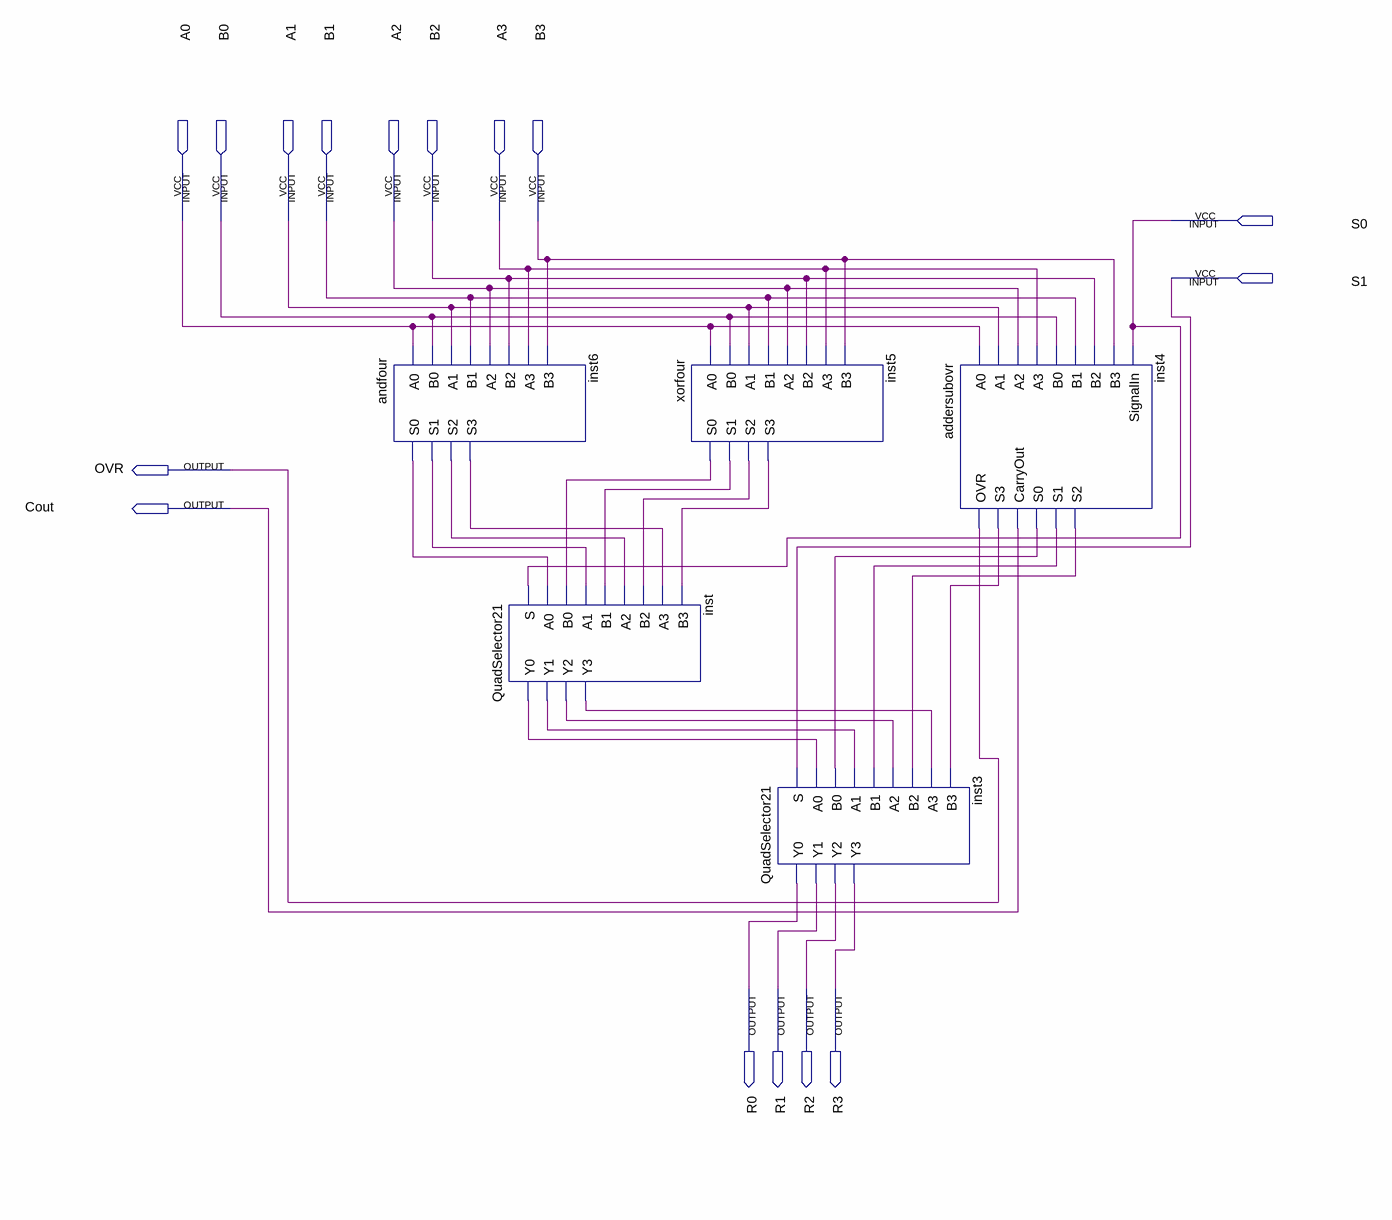
[diagram p0: schematic sheet]
// Quartus schematic alu.bdf as structural Verilog: 5 symbols, 16 pins
module alu (
  input  A0,
  input  B0,
  input  A1,
  input  B1,
  input  A2,
  input  B2,
  input  A3,
  input  B3,
  input  S0,
  input  S1,
  output OVR,
  output Cout,
  output R0,
  output R1,
  output R2,
  output R3
);

  wire inst4_s0, inst4_s1, inst4_s2, inst4_s3, inst5_s0, inst5_s1, inst5_s2, inst5_s3, inst6_s0, inst6_s1,
       inst6_s2, inst6_s3, inst_y0, inst_y1, inst_y2, inst_y3;

  andfour inst6 (
    .A0(A0), .B0(B0), .A1(A1), .B1(B1), .A2(A2), .B2(B2), .A3(A3), .B3(B3), .S0(inst6_s0), .S1(inst6_s1),
    .S2(inst6_s2), .S3(inst6_s3));
  QuadSelector21 inst (
    .S(S0), .A0(inst6_s0), .B0(inst5_s0), .A1(inst6_s1), .B1(inst5_s1), .A2(inst6_s2), .B2(inst5_s2),
    .A3(inst6_s3), .B3(inst5_s3), .Y0(inst_y0), .Y1(inst_y1), .Y2(inst_y2), .Y3(inst_y3));
  xorfour inst5 (
    .A0(A0), .B0(B0), .A1(A1), .B1(B1), .A2(A2), .B2(B2), .A3(A3), .B3(B3), .S0(inst5_s0), .S1(inst5_s1),
    .S2(inst5_s2), .S3(inst5_s3));
  QuadSelector21 inst3 (
    .S(S1), .A0(inst_y0), .B0(inst4_s0), .A1(inst_y1), .B1(inst4_s1), .A2(inst_y2), .B2(inst4_s2),
    .A3(inst_y3), .B3(inst4_s3), .Y0(R0), .Y1(R1), .Y2(R2), .Y3(R3));
  addersubovr inst4 (
    .A0(A0), .A1(A1), .A2(A2), .A3(A3), .B0(B0), .B1(B1), .B2(B2), .B3(B3), .SignalIn(S0), .OVR(OVR),
    .S3(inst4_s3), .CarryOut(Cout), .S0(inst4_s0), .S1(inst4_s1), .S2(inst4_s2));
endmodule
